# EAGLE design AutonomousBot_Shield (EAGLE 8.5.1)
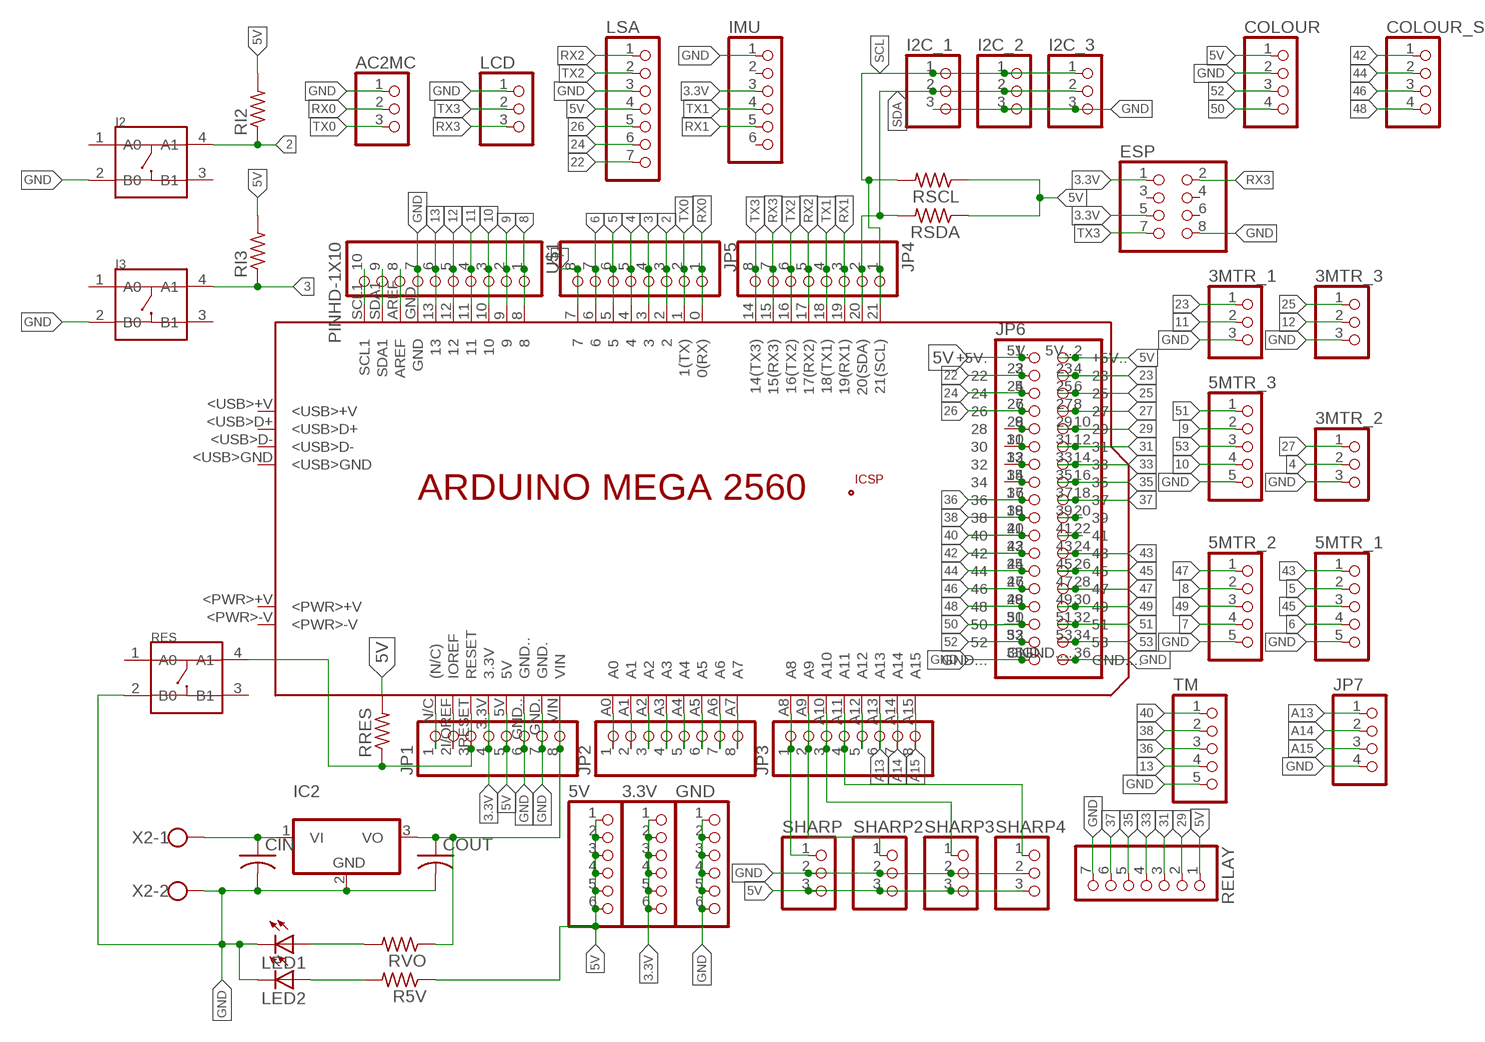
[diagram p0: schematic, sheet 1]

## Parts
3.3V  PINHD-1X6  [1X06]
3MTR_1  PINHD-1X3  [1X03]
3MTR_2  PINHD-1X3  [1X03]
3MTR_3  PINHD-1X3  [1X03]
5MTR_1  PINHD-1X5  [1X05]
5MTR_2  PINHD-1X5  [1X05]
5MTR_3  PINHD-1X5  [1X05]
5V  PINHD-1X6  [1X06]
AC2MC  PINHD-1X3  [1X03]
CIN  C-US025-024X044  [C025-024X044]
COLOUR  PINHD-1X4  [1X04]
COLOUR_S  PINHD-1X4  [1X04]
COUT  C-US025-024X044  [C025-024X044]
ESP  PINHD-2X4  [2X04]
GND  PINHD-1X6  [1X06]
I2  DIP-SWITCH-TACTILE-SPST-NO/TS-1109(4P-D6.0MM)'TS-1109'  [SW4-6.0X6.0X5.0MM]
I2C_1  PINHD-1X3  [1X03]
I2C_2  PINHD-1X3  [1X03]
I2C_3  PINHD-1X3  [1X03]
I3  DIP-SWITCH-TACTILE-SPST-NO/TS-1109(4P-D6.0MM)'TS-1109'  [SW4-6.0X6.0X5.0MM]
IC2  7812TV  [TO220V]
IMU  PINHD-1X6  [1X06]
JP1  PINHD-1X8BIG  [1X08-BIG]
JP2  PINHD-1X8BIG  [1X08-BIG]
JP3  PINHD-1X8BIG  [1X08-BIG]
JP4  PINHD-1X8BIG  [1X08-BIG]
JP5  PINHD-1X8BIG  [1X08-BIG]
JP6  PINHD-2X18  [2X18]
JP7  PINHD-1X4  [1X04]
LCD  PINHD-1X3  [1X03]
LED1  LED5MM  [LED5MM]
LED2  LED5MM  [LED5MM]
LSA  PINHD-1X7  [1X07]
PCB1  ARDUINO_MEGA2560  [ARDUINO_MEGA2560]
R5V  R-US_0207/7  [0207/7]
RELAY  PINHD-1X7  [1X07]
RES  DIP-SWITCH-TACTILE-SPST-NO/TS-1109(4P-D6.0MM)'TS-1109'  [SW4-6.0X6.0X5.0MM]
RI2  R-US_0207/7  [0207/7]
RI3  R-US_0207/7  [0207/7]
RRES  R-US_0207/7  [0207/7]
RSCL  R-US_0207/7  [0207/7]
RSDA  R-US_0207/7  [0207/7]
RVO  R-US_0207/7  [0207/7]
SHARP  PINHD-1X3  [1X03]
SHARP2  PINHD-1X3  [1X03]
SHARP3  PINHD-1X3  [1X03]
SHARP4  PINHD-1X3  [1X03]
TM  PINHD-1X5  [1X05]
U$1  PINHD-1X10  [1X10-BIG]
X2  W237-102  [W237-102]

## Nets
2: I2.4(A1) JP5.3 PCB1.2 RI2.1
3: I3.4(A1) JP5.4 PCB1.3 RI3.1
3.3V: 3.3V.1 3.3V.2 3.3V.3 3.3V.4 3.3V.5 3.3V.6 ESP.1 ESP.5 IMU.3 JP1.4 PCB1.3.3V
4: 3MTR_2.2 JP5.5 PCB1.4
5: 5MTR_1.2 JP5.6 PCB1.5
5V: 5V.1 5V.2 5V.3 5V.4 5V.5 5V.6 COLOUR.1 JP1.5 JP6.1 JP6.2 LSA.4 PCB1.5V PCB1.5V.(+5V.) PCB1.5V..(+5V..) R5V.1 RELAY.1 RI2.2 RI3.2 RRES.2 RSCL.1 RSDA.1 SHARP2.3 SHARP3.3 SHARP4.3 SHARP.3
6: 5MTR_1.4 JP5.7 PCB1.6
7: 5MTR_2.4 JP5.8 PCB1.7
8: 5MTR_2.2 PCB1.8 U$1.1
9: 5MTR_3.2 PCB1.9 U$1.2
10: 5MTR_3.4 PCB1.10 U$1.3
11: 3MTR_1.2 PCB1.11 U$1.4
12: 3MTR_3.2 PCB1.12 U$1.5
13: PCB1.13 TM.4 U$1.6
22: JP6.3 LSA.7 PCB1.22
23: 3MTR_1.1 JP6.4 PCB1.23
24: JP6.5 LSA.6 PCB1.24
25: 3MTR_3.1 JP6.6 PCB1.25
26: JP6.7 LSA.5 PCB1.26
27: 3MTR_2.1 JP6.8 PCB1.27
29: JP6.10 PCB1.29 RELAY.2
31: JP6.12 PCB1.31 RELAY.3
33: JP6.14 PCB1.33 RELAY.4
35: JP6.16 PCB1.35 RELAY.5
36: JP6.17 PCB1.36 TM.3
37: JP6.18 PCB1.37 RELAY.6
38: JP6.19 PCB1.38 TM.2
40: JP6.21 PCB1.40 TM.1
42: COLOUR_S.1 JP6.23 PCB1.42
43: 5MTR_1.1 JP6.24 PCB1.43
44: COLOUR_S.2 JP6.25 PCB1.44
45: 5MTR_1.3 JP6.26 PCB1.45
46: COLOUR_S.3 JP6.27 PCB1.46
47: 5MTR_2.1 JP6.28 PCB1.47
48: COLOUR_S.4 JP6.29 PCB1.48
49: 5MTR_2.3 JP6.30 PCB1.49
50: COLOUR.4 JP6.31 PCB1.50
51: 5MTR_3.1 JP6.32 PCB1.51
52: COLOUR.3 JP6.33 PCB1.52
53: 5MTR_3.3 JP6.34 PCB1.53
A13: JP3.6 JP7.1 PCB1.A13
A14: JP3.7 JP7.2 PCB1.A14
A15: JP3.8 JP7.3 PCB1.A15
GND: 3MTR_1.3 3MTR_2.3 3MTR_3.3 5MTR_1.5 5MTR_2.5 5MTR_3.5 AC2MC.1 CIN.2 COLOUR.2 COUT.2 ESP.8 GND.1 GND.2 GND.3 GND.4 GND.5 GND.6 I2.2(B0) I2C_1.3 I2C_2.3 I2C_3.3 I3.2(B0) IC2.2(GND) IMU.1 JP1.6 JP1.7 JP6.35 JP6.36 JP7.4 LCD.1 LED1.K(C) LED2.K(C) LSA.3 PCB1.GND PCB1.GND. PCB1.GND.. PCB1.GND... PCB1.GND.... RELAY.7 RES.2(B0) SHARP2.2 SHARP3.2 SHARP4.2 SHARP.2 TM.5 U$1.7 X2.2
N$1: CIN.1 IC2.1(VI) X2.1
N$2: COUT.1 IC2.3(VO) JP1.8 PCB1.VIN RVO.1
N$3: LED2.A R5V.2
N$4: LED1.A RVO.2
N$5: JP1.3 PCB1.RESET RES.4(A1) RRES.1
N$6: JP1.2 PCB1.I/OREF(IOREF)
N$7: JP1.1 PCB1.N/C((N/C))
N$8: JP6.9 PCB1.28
N$9: JP2.1 PCB1.A0
N$10: JP2.2 PCB1.A1
N$11: JP2.3 PCB1.A2
N$12: JP2.4 PCB1.A3
N$13: JP2.5 PCB1.A4
N$14: JP6.20 PCB1.39
N$15: JP6.22 PCB1.41
N$16: JP2.6 PCB1.A5
N$17: JP2.7 PCB1.A6
N$18: JP2.8 PCB1.A7
N$19: JP3.1 PCB1.A8 SHARP.1
N$20: JP3.2 PCB1.A9 SHARP2.1
N$21: JP3.3 PCB1.A10 SHARP3.1
N$22: JP3.4 PCB1.A11 SHARP4.1
N$23: JP3.5 PCB1.A12
N$50: PCB1.AREF U$1.8
N$51: PCB1.SDA1 U$1.9
N$52: PCB1.SCL1 U$1.10
N$63: JP6.15 PCB1.34
N$64: JP6.13 PCB1.32
N$65: JP6.11 PCB1.30
RX0: AC2MC.2 JP5.1 PCB1.0(0(RX))
RX1: IMU.5 JP4.3 PCB1.19(19(RX1))
RX2: JP4.5 LSA.1 PCB1.17(17(RX2))
RX3: ESP.2 JP4.7 LCD.3 PCB1.15(15(RX3))
SCL: I2C_1.1 I2C_2.1 I2C_3.1 JP4.1 PCB1.21(21(SCL)) RSCL.2
SDA: I2C_1.2 I2C_2.2 I2C_3.2 JP4.2 PCB1.20(20(SDA)) RSDA.2
TX0: AC2MC.3 JP5.2 PCB1.1(1(TX))
TX1: IMU.4 JP4.4 PCB1.18(18(TX1))
TX2: JP4.6 LSA.2 PCB1.16(16(TX2))
TX3: ESP.7 JP4.8 LCD.2 PCB1.14(14(TX3))
Unconnected: ESP.3 ESP.4 ESP.6 I2.1(A0) I2.3(B1) I3.1(A0) I3.3(B1) IMU.2 IMU.6 PCB1.+5V_ PCB1.<PWR>+V PCB1.<PWR>-V PCB1.<USB>+V PCB1.<USB>D+ PCB1.<USB>D- PCB1.<USB>GND PCB1.GND__ PCB1.MISO PCB1.MOSI PCB1.RESET. PCB1.SCK RES.1(A0) RES.3(B1)

## Library data of the parts
3.3V 5V GND IMU = adafruit:PINHD-1X6: PIN HEADER
3MTR_1-3MTR_3 = pinhead:PINHD-1X3: PIN HEADER
5MTR_1-5MTR_3 TM = pinhead:PINHD-1X5: PIN HEADER
AC2MC I2C_1-I2C_3 LCD SHARP SHARP2-SHARP4 = adafruit:PINHD-1X3: PIN HEADER
CIN COUT = adafruit:C-US: CAPACITOR, American symbol
COLOUR COLOUR_S JP7 = pinhead:PINHD-1X4: PIN HEADER
ESP = adafruit:PINHD-2X4: PIN HEADER
I2 I3 RES = Seeed-Switch:DIP-SWITCH-TACTILE-SPST-NO/TS-1109(4P-D6.0MM): 311020024
IC2 = linear:78*: Positive VOLTAGE REGULATOR Source: http://cache.national.com/ds/LM/LM78L05.pdf http://www.fairchildsemi.com/ds/LM/LM7805.pdf
JP1-JP5 = adafruit:PINHD-1X8: PIN HEADER
JP6 = pinhead:PINHD-2X18: PIN HEADER
LED1 LED2 = adafruit:LED: LED OSRAM: - CHIPLED LG R971, LG N971, LY N971, LG Q971, LY Q971, LO R971, LY R971 LH N974, LH R974 LS Q976, LO Q976, LY Q976 LO Q996 - Hyper CHIPLED LW Q18S LB Q993, LB Q99A, LB R99A - SideLED LS A670, LO A670, LY A670, LG A670, LP A670 LB A673, LV A673, LT A673, LW A673 LH A674 LY A675 LS A676, LA A676, LO A676, LY A676, LW A676 LS A679, LY A679, LG A679 - Hyper Micro SIDELED® LS Y876, LA Y876, LO Y876, LY Y876 LT Y87S - SmartLED LW L88C, LW L88S LB L89C, LB L89S, LG L890 LS L89K, LO L89K, LY L89K LS L896, LA L896, LO L896, LY L896 - TOPLED LS T670, LO T670, LY T670, LG T670, LP T670 LSG T670, LSP T670, LSY T670, LOP T670, LYG T670 LG T671, LOG T671, LSG T671 LB T673, LV T673, LT T673, LW T673 LH T674 LS T676, LA T676, LO T676, LY T676, LB T676, LH T676, LSB T676, LW T676 LB T67C, LV T67C, LT T67C, LS T67K, LO T67K, LY T67K, LW E67C LS E67B, LA E67B, LO E67B, LY E67B, LB E67C, LV E67C, LT E67C LW T67C LS T679, LY T679, LG T679 LS T770, LO T770, LY T770, LG T770, LP T770 LB T773, LV T773, LT T773, LW T773 LH T774 LS E675, LA E675, LY E675, LS T675 LS T776, LA T776, LO T776, LY T776, LB T776 LHGB T686 LT T68C, LB T68C - Hyper Mini TOPLED® LB M676 - Mini TOPLED Santana® LG M470 LS M47K, LO M47K, LY M47K Source: http://www.osram.convergy.de/
LSA RELAY = pinhead:PINHD-1X7: PIN HEADER
PCB1 = E14_Arduino_revC:ARDUINO_MEGA2560: Device for representing an Arduino Mega 2560 board with a footprint in an EAGLE design. Created by Dave Young for Element14. More EAGLE documentation at: http://www.element14.com/community/community/knode/cadsoft_eagle
R5V RI2 RI3 RRES RSCL RSDA RVO = adafruit:R-US_: RESISTOR, American symbol
U$1 = adafruit:PINHD-1X10: Pin header 1x10 0.1" spacing With round pins
X2 = con-wago-500:W237-102: WAGO SCREW CLAMP; MPN: 237-102; OC_FARNELL: unknown; OC_NEWARK: 70K9898

## Board
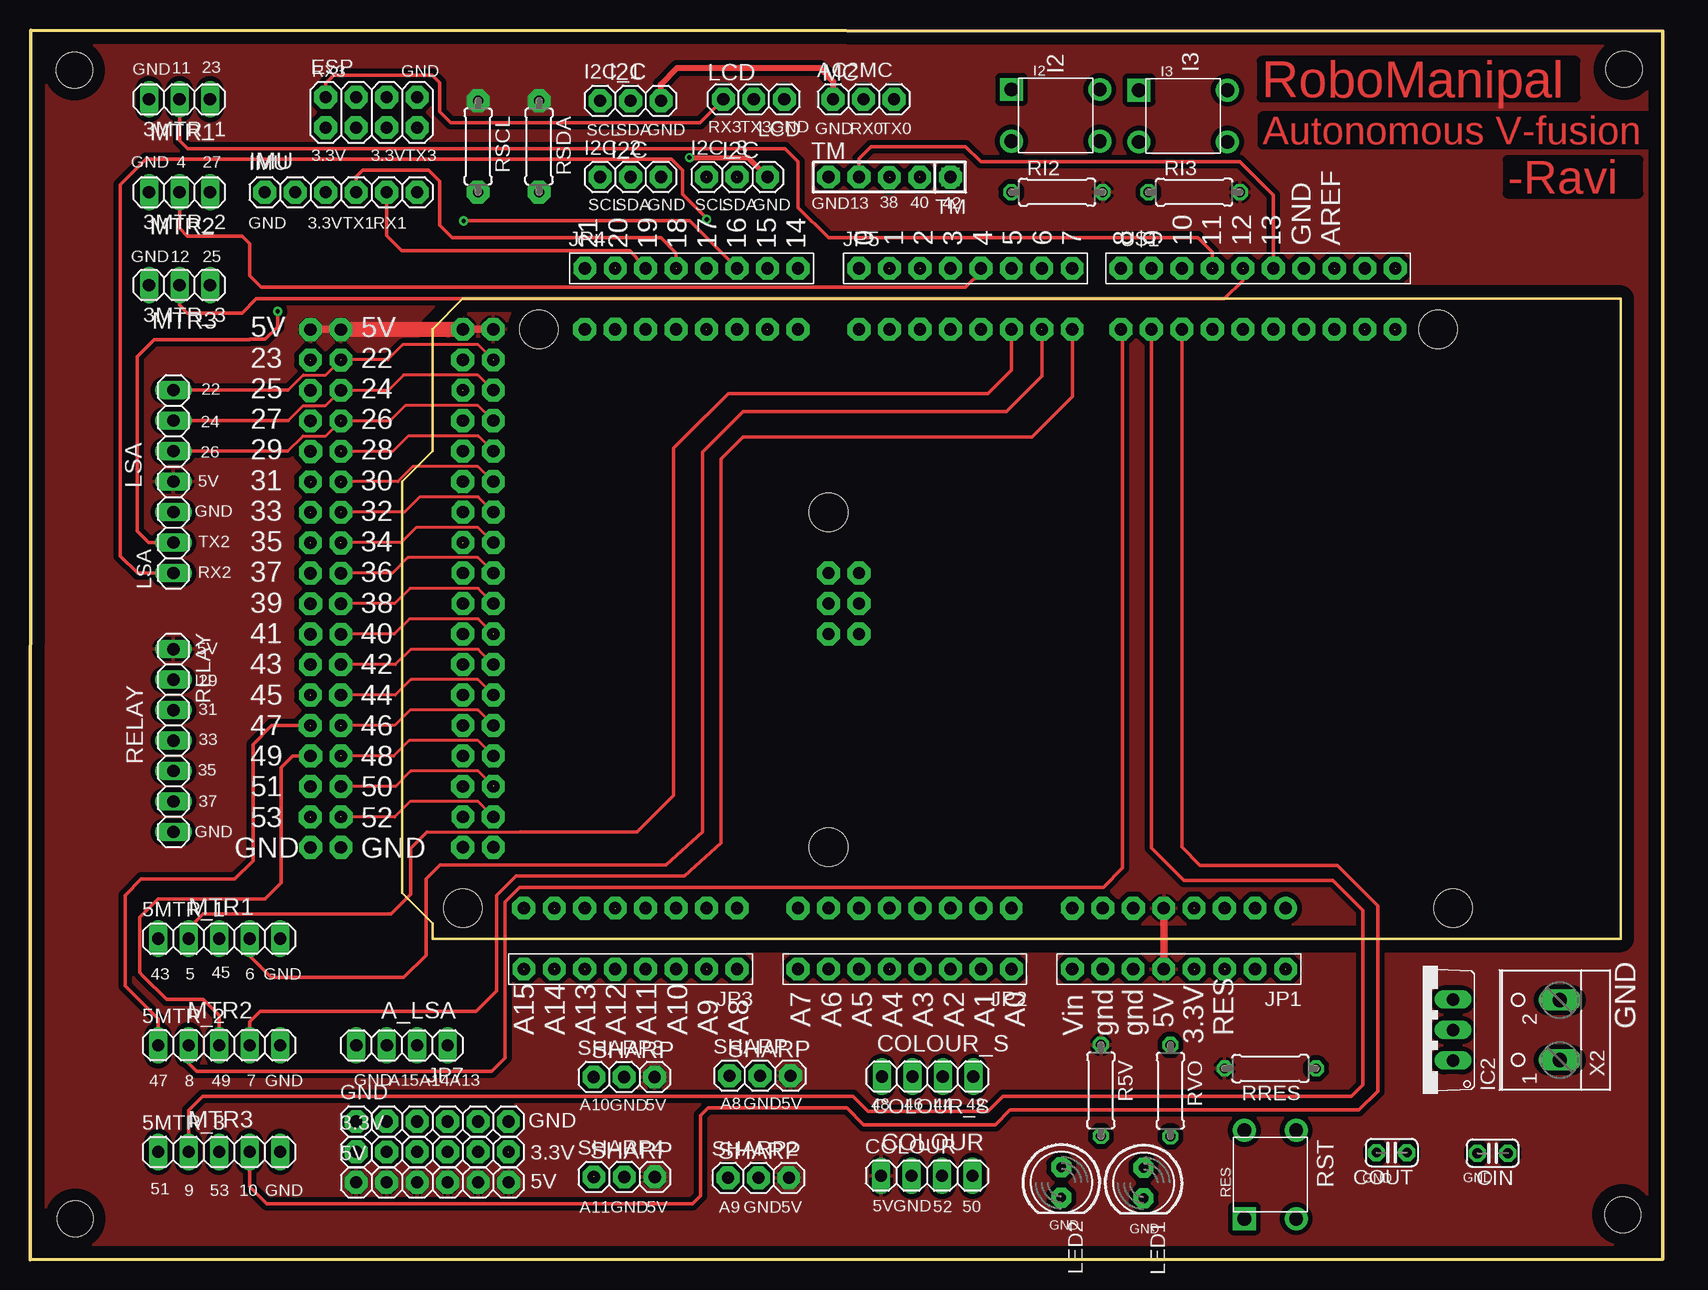
[diagram p1: board, top side]
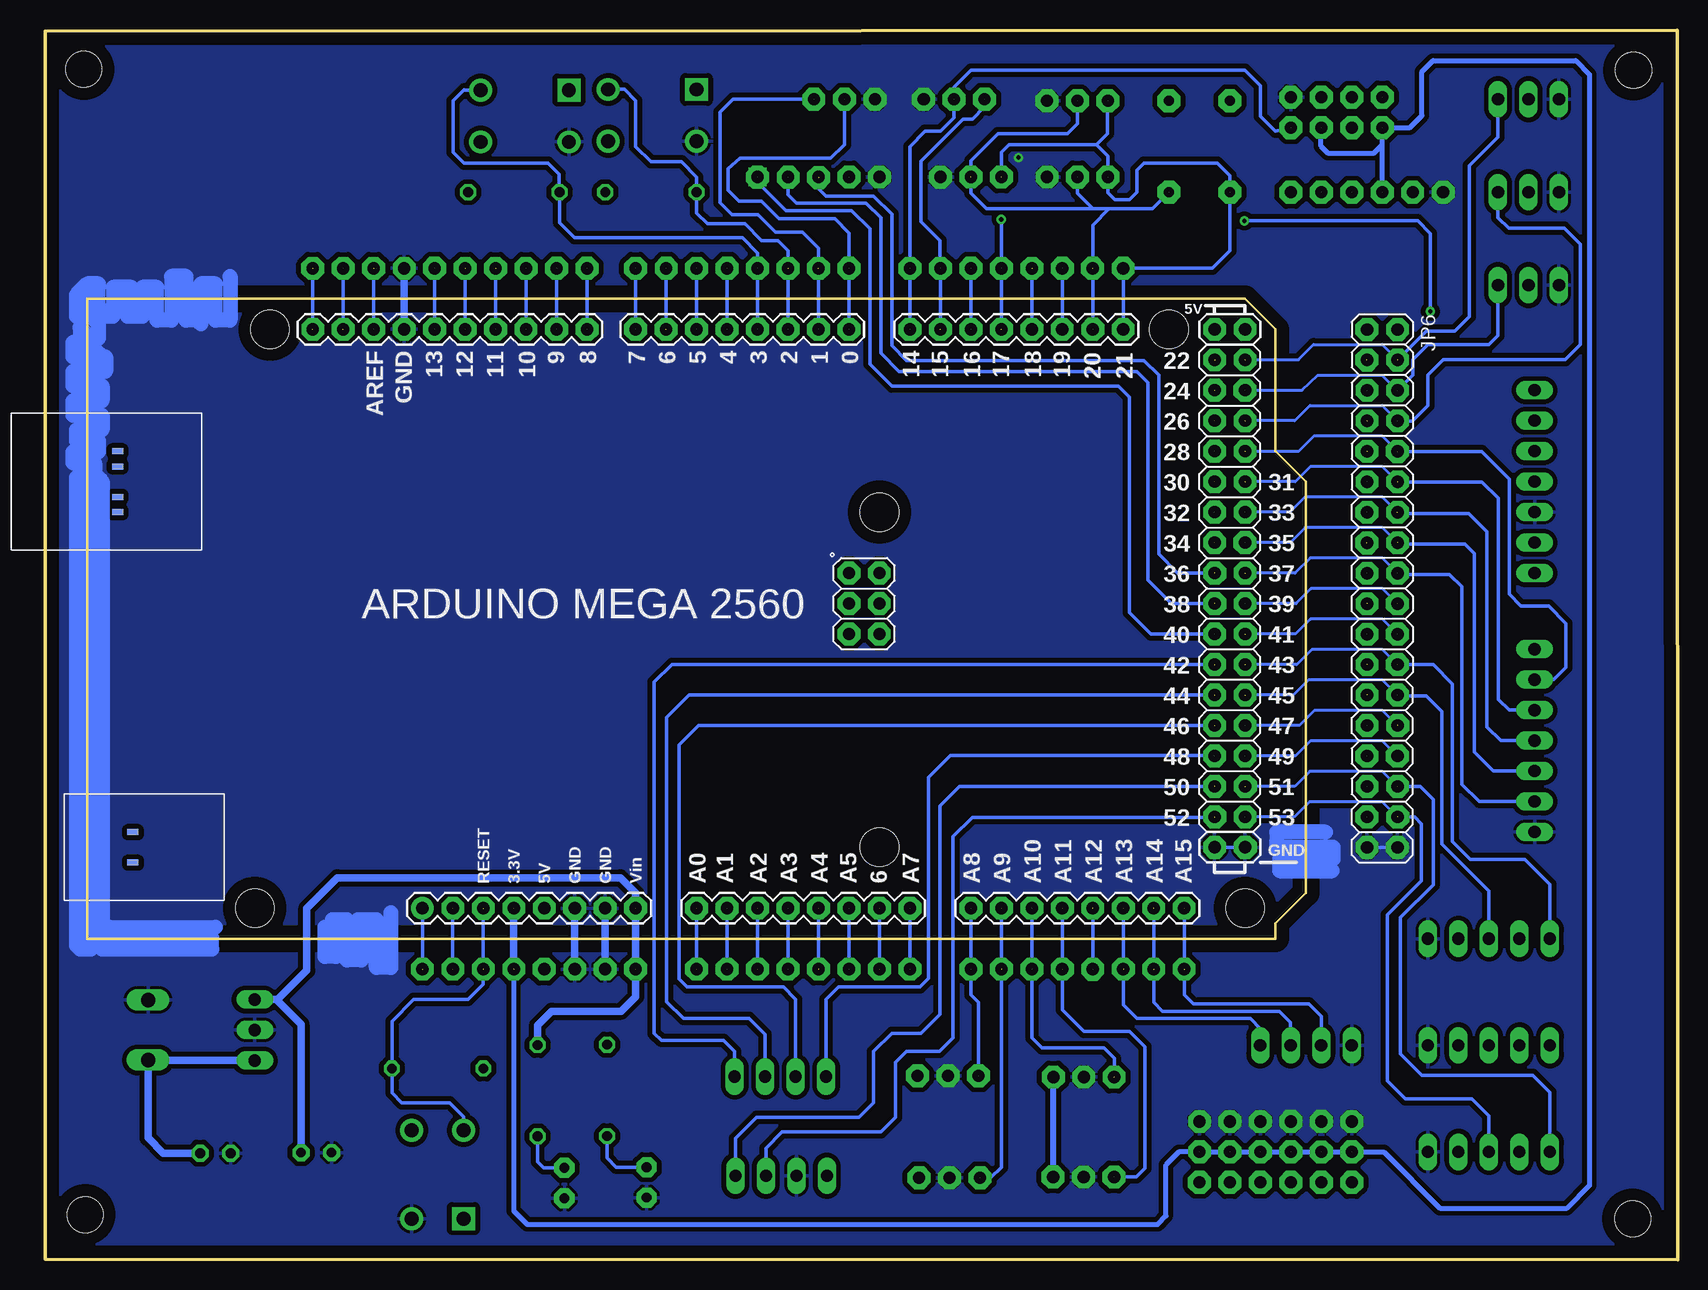
[diagram p2: board, bottom side, seen from below]

Size 136.09 x 102.53 mm. Coordinates in mm from the lower left corner, seen from the top.
Outline: 0,0 136.09,0.05 136.09,102.44 0.07,102.53 0,0
Copper layers (1*16): Top 0.035mm / dielectric 1.5mm / Bottom 0.035mm
Design rules "default": minimum track width 6mil, minimum drill 0.35mm, track to track 6mil, track to pad 6mil, pad to pad 6mil, via to via 6mil, smd to smd 6mil, copper to edge 40mil, drill to drill 6mil, minimum pad ring 10mil, minimum via ring 8mil, stop-mask expansion 4mil, vias tented up to drill 0mil, thermal gap 10mil
Holes 3 mm at 3.78,3.42 3.71,99.18 132.88,99.25 132.76,3.77

### Footprints (pad centres in the part's own frame; a part is rotated, then mirrored left to right if it is on the bottom)
1X06 = drill 1.016 octagon: 1 -6.35,0; 2 -3.81,0; 3 -1.27,0; 4 1.27,0; 5 3.81,0; 6 6.35,0
1X03 = drill 1.016 long: 1 -2.54,0; 2 0,0; 3 2.54,0
1X05 = drill 1.016 long: 1 -5.08,0; 2 -2.54,0; 3 0,0; 4 2.54,0; 5 5.08,0
1X03' = drill 1.016: 1 -2.54,0; 2 0,0; 3 2.54,0
C025-024X044 = drill 0.813 pad 1.422 octagon: 1 -1.27,0; 2 1.27,0
1X04 = drill 1.016 long: 1 -3.81,0; 2 -1.27,0; 3 1.27,0; 4 3.81,0
2X04 = drill 1.016 pad 1.676 octagon: 1 -3.81,-1.27; 2 -3.81,1.27; 3 -1.27,-1.27; 4 -1.27,1.27; 5 1.27,-1.27; 6 1.27,1.27; 7 3.81,-1.27; 8 3.81,1.27
SW4-6.0X6.0X5.0MM = drill 1.143 pad 1.905 square: 1 -3.683,2.159 | drill 1.143 pad 1.905: 2 -3.683,-2.159; 3 3.683,-2.159; 4 3.683,2.159
TO220V = drill 1.016 long: 1 -2.54,-2.54; 2 0,-2.54; 3 2.54,-2.54
1X08-BIG = drill 1.016 pad 1.778 octagon: 1 -8.89,0; 2 -6.35,0; 3 -3.81,0; 4 -1.27,0; 5 1.27,0; 6 3.81,0; 7 6.35,0; 8 8.89,0
2X18 = drill 1.016 octagon: 1 -21.59,-1.27; 2 -21.59,1.27; 3 -19.05,-1.27; 4 -19.05,1.27; 5 -16.51,-1.27; 6 -16.51,1.27; 7 -13.97,-1.27; 8 -13.97,1.27; 9 -11.43,-1.27; 10 -11.43,1.27; 11 -8.89,-1.27; 12 -8.89,1.27; 13 -6.35,-1.27; 14 -6.35,1.27; 15 -3.81,-1.27; 16 -3.81,1.27; 17 -1.27,-1.27; 18 -1.27,1.27; 19 1.27,-1.27; 20 1.27,1.27; 21 3.81,-1.27; 22 3.81,1.27; 23 6.35,-1.27; 24 6.35,1.27; 25 8.89,-1.27; 26 8.89,1.27; 27 11.43,-1.27; 28 11.43,1.27; 29 13.97,-1.27; 30 13.97,1.27; 31 16.51,-1.27; 32 16.51,1.27; 33 19.05,-1.27; 34 19.05,1.27; 35 21.59,-1.27; 36 21.59,1.27
LED5MM = drill 0.813 pad 1.676 octagon: A -1.27,0; K 1.27,0
1X07 = drill 1.016 long: 1 -7.62,0; 2 -5.08,0; 3 -2.54,0; 4 0,0; 5 2.54,0; 6 5.08,0; 7 7.62,0
ARDUINO_MEGA2560 = drill 1.016 pad 1.88: 0 63.5,50.8; 1 60.96,50.8; 2 58.42,50.8; 3 55.88,50.8; 3.3V 35.56,2.54; 4 53.34,50.8; 5 50.8,50.8; 5V 38.1,2.54; 5V. 93.98,50.8; 5V.. 96.52,50.8; 6 48.26,50.8; 7 45.72,50.8; 8 41.656,50.8; 9 39.116,50.8; 10 36.576,50.8; 11 34.036,50.8; 12 31.496,50.8; 13 28.956,50.8; 14 68.58,50.8; 15 71.12,50.8; 16 73.66,50.8; 17 76.2,50.8; 18 78.74,50.8; 19 81.28,50.8; 20 83.82,50.8; 21 86.36,50.8; A0 50.8,2.54; A1 53.34,2.54; A2 55.88,2.54; A3 58.42,2.54; A4 60.96,2.54; A5 63.5,2.54; A6 66.04,2.54; A7 68.58,2.54; A8 73.66,2.54; A9 76.2,2.54; A10 78.74,2.54; A11 81.28,2.54; A12 83.82,2.54; A13 86.36,2.54; A14 88.9,2.54; A15 91.44,2.54; AREF 23.876,50.8; GND 26.416,50.8; GND. 43.18,2.54; GND.. 40.64,2.54; GND... 93.98,7.62; GND.... 96.52,7.62; I/OREF 30.48,2.54; N/C 27.94,2.54; RESET 33.02,2.54; SCL1 18.796,50.8; SDA1 21.336,50.8; VIN 45.72,2.54 | drill 1.016 pad 1.88 octagon: 22 93.98,48.26; 23 96.52,48.26; 24 93.98,45.72; 25 96.52,45.72; 26 93.98,43.18; 27 96.52,43.18; 28 93.98,40.64; 29 96.52,40.64; 30 93.98,38.1; 31 96.52,38.1; 32 93.98,35.56; 33 96.52,35.56; 34 93.98,33.02; 35 96.52,33.02; 36 93.98,30.48; 37 96.52,30.48; 38 93.98,27.94; 39 96.52,27.94; 40 93.98,25.4; 41 96.52,25.4; 42 93.98,22.86; 43 96.52,22.86; 44 93.98,20.32; 45 96.52,20.32; 46 93.98,17.78; 47 96.52,17.78; 48 93.98,15.24; 49 96.52,15.24; 50 93.98,12.7; 51 96.52,12.7; 52 93.98,10.16; 53 96.52,10.16; +5V_ 66.04,30.48; GND__ 66.04,25.4; MISO 63.5,30.48; MOSI 66.04,27.94; RESET. 63.5,25.4; SCK 63.5,27.94 | smd 1.016 x 0.508: <PWR>+V 3.81,8.89; <PWR>-V 3.81,6.35; <USB>+V 2.54,40.64; <USB>D+ 2.54,39.37; <USB>D- 2.54,36.83; <USB>GND 2.54,35.56 | hole 3.2: 15.24,50.8; 13.97,2.54; 66.04,35.56; 66.04,7.62; 90.17,50.8; 96.52,2.54
0207/7 = drill 0.813 octagon: 1 -3.81,0; 2 3.81,0
1X05' = drill 1.016 square: 1 -5.08,0 | drill 1.016 octagon: 2 -2.54,0; 3 0,0; 4 2.54,0; 5 5.08,0
1X10-BIG = drill 1.016 pad 1.778 octagon: 1 -11.43,0; 2 -8.89,0; 3 -6.35,0; 4 -3.81,0; 5 -1.27,0; 6 1.27,0; 7 3.81,0; 8 6.35,0; 9 8.89,0; 10 11.43,0
W237-102 = drill 1.194 long: 1 -2.5,-1.27; 2 2.5,-1.27

### Placement (x,y rotation side)
3.3V  33.54,9 0 top
3MTR_1  12.46,96.75 180 top
3MTR_2  12.46,89.01 180 top
3MTR_3  12.46,81.26 180 top
5MTR_1  15.76,26.78 0 top
5MTR_2  15.76,17.89 0 top
5MTR_3  15.76,9 0 top
5V  33.54,6.46 0 top
AC2MC  [1X03']  69.48,96.75 0 top
CIN  121.92,8.89 180 top
COLOUR  74.76,7.01 0 top
COLOUR_S  74.82,15.28 180 top
COUT  113.51,8.94 180 top
ESP  28.46,95.66 0 top
GND  33.54,11.54 0 top
I2  85.49,95.42 0 top
I2C_1  [1X03']  50.05,96.63 0 top
I2C_2  [1X03']  50.05,90.28 0 top
I2C_3  [1X03']  58.94,90.28 0 top
I3  96.13,95.36 0 top
IC2  116.09,19.16 90 top
IMU  25.92,89.01 0 top
JP1  95.77,24.24 180 top
JP2  72.91,24.24 180 top
JP3  50.05,24.24 180 top
JP4  55.13,82.66 0 top
JP5  77.99,82.66 0 top
JP6  24.65,55.97 270 bottom
JP7  31.01,17.88 180 top
LCD  [1X03']  60.34,96.75 180 top
LED1  92.83,6.41 270 top
LED2  85.97,6.46 270 top
LSA  11.95,64.88 90 top
PCB1  132.6,26.78 0 bottom
R5V  89.27,14.13 270 top
RELAY  11.95,43.29 270 top
RES  103.39,7.12 90 top
RI2  85.61,89.01 0 top
RI3  97.04,89.01 0 top
RRES  103.39,15.96 180 top
RSCL  37.35,92.82 270 top
RSDA  42.43,92.82 270 top
RVO  95.06,14.1 270 top
SHARP  [1X03']  60.85,15.35 0 top
SHARP2  [1X03']  60.72,6.84 0 top
SHARP3  [1X03']  49.53,15.24 0 top
SHARP4  [1X03']  49.54,6.91 0 top
TM  [1X05']  71.64,90.28 180 top
U$1  102.38,82.66 0 top
X2  126.25,19.16 90 top

### Tracks (layer width: path | path; a pad name or v marks a point on that pad's centre or on a via)
2  (via drill 0.75 pad 1.91)  (2 unrouted)
  Bottom 0.305: PCB1.2 JP5.3 | JP5.3 74.18,82.78 | 77.77,86.36 77.79,86.36 | 77.79,86.36 79.16,86.36 79.17,86.38 80.9,86.38 81.8,87.28 RI2.1 81.8,90.28 83.07,91.55 85.61,91.55 86.88,92.82 86.88,96.64 87.82,97.58 I2.4 | JP5.3 74.18,84.15 75.01,84.97 76.4,84.97 77.79,86.36
  other vias: 74.18,82.65 74.19,77.58
3  (via drill 0.75 pad 1.91)  (2 unrouted)
  Bottom 0.305: PCB1.3 JP5.4 76.72,83.93 77.99,85.2 91.96,85.2 93.23,86.47 RI3.1 93.27,89.04 93.27,90.53 94.18,91.44 101.19,91.44 102.11,92.35 102.11,96.62 101.19,97.54 101.17,97.52 I3.4
  other vias: 76.73,82.66 76.72,77.58
3.3V  (via drill 0.65 pad 1.91, 0.75 pad 1.91)  (11 unrouted)
  Bottom 0.305: 29.75,94.07 ESP.5
  Bottom 0.406: 29.75,94.07 29.75,92.86 29.17,92.28 25.34,92.28 24.65,92.96 | IMU.3 24.65,92.96 | 24.65,92.96 ESP.1 | 24.35,94.39 ESP.1 | JP1.4 97.04,14.61 97.04,14.33 97.04,4.08 95.92,2.96 43.37,2.96 42.67,3.66 42.67,7.93 41.6,9 3.3V.6 3.3V.5 3.3V.4 | ESP.1 22.34,94.39 21.33,95.4 21.33,99.06 20.42,99.97 8.53,99.97 7.37,98.81 7.37,6.21 9.26,4.32 19.85,4.32 24.53,9 3.3V.1 | 3.3V.4 | 3.3V.4 v32.28,9 | 3.3V.3 3.3V.2 v29.73,8.99 | 3.3V.2 3.3V.1
  Bottom 0.61: PCB1.3.3V JP1.4
  other vias: 27.19,9 34.81,9 37.35,9 39.87,9.02 24.65,89.01 29.73,94.4 24.65,94.39 97.04,29.32 97.04,24.24
4  (via drill 0.75 pad 1.91)  (2 unrouted)
  Top 0.305: 79.26,82.63 JP5.5 79.26,82.36 77.99,81.09 19.25,81.09 18.3,82.04 18.3,84.72 17.68,85.34 13.1,85.34 12.46,85.99 3MTR_2.2
  Bottom 0.305: PCB1.4 JP5.5
  other vias: 79.26,82.67 79.27,77.58
5  (via drill 0.75 pad 1.91)  (2 unrouted)
  Top 0.254: 33.12,35.67 40.85,35.67
  Top 0.305: 5MTR_1.2 13.22,27.62 14.45,28.85 30.11,28.85 31.75,30.48 31.75,34.29 33.12,35.67 | 81.82,77.55 PCB1.5 81.8,74.18 79.86,72.24 58.22,72.24 54.56,68.58 53.95,67.97 53.64,67.67 53.64,38.71 50.6,35.66 40.85,35.66 40.85,35.67 40.84,35.66
  Bottom 0.305: PCB1.5 JP5.6
  other vias: 81.8,82.66 81.8,77.57
5V  (via drill 0.75 pad 1.91)
  Top 0.61: PCB1.5V JP1.5 | JP6.2 23.39,77.58 25.93,77.58 | 36.07,77.56 PCB1.5V.. PCB1.5V.
  Top 1.27: 25.93,77.58 PCB1.5V..
  Top 1.778: JP6.1 25.93,77.58
  Bottom 0.508: SHARP3.3 52.09,15.22 v52.09,6.91
  other vias: 94.5,29.32 94.5,24.24 63.26,6.84 63.39,15.35 52.07,15.24 27.19,6.45 29.73,6.46 32.28,6.45 34.81,6.47 37.35,6.45 39.89,6.47 37.35,96.63 42.44,96.62 38.62,77.58 36.08,77.58 25.92,77.56 23.38,77.56
  pour Top (isolate 0.406): -1.27,104.14 -1.27,-1.27 138.43,-1.27 138.43,104.14
6  (via drill 0.75 pad 1.91)  (2 unrouted)
  Top 0.305: 5MTR_1.4 18.3,25.35 20.12,23.53 31.15,23.53 33.02,25.4 33.02,31.75 34.19,32.92 53.03,32.92 56.08,35.66 56.08,67.36 59.43,70.71 81.38,70.71 84.34,73.68 PCB1.6 v84.35,77.57
  Bottom 0.305: PCB1.6 JP5.7
  other vias: 84.33,82.66
7  (via drill 0.75 pad 1.91)  (2 unrouted)
  Top 0.305: 86.84,77.54 PCB1.7 86.88,71.95 83.51,68.58 59.43,68.58 57.61,66.75 57.61,34.75 54.56,32 40.53,32 38.9,30.38 38.9,22.45 37.18,20.73 19.2,20.73 18.3,19.83 5MTR_2.4
  Bottom 0.305: PCB1.7 JP5.8
  other vias: 86.88,82.66 86.88,77.58
8  (via drill 0.75 pad 1.91)  (2 unrouted)
  Top 0.305: PCB1.8 91.08,77.45 91.08,32.66 89.48,31.06 40.81,31.06 39.59,29.85 39.59,29.84 39.59,16.84 38.48,15.73 13.89,15.73 13.22,16.4 5MTR_2.2
  Bottom 0.305: PCB1.8 U$1.1
  other vias: 90.94,82.67 90.94,77.58
9  (via drill 0.75 pad 1.91)  (2 unrouted)
  Top 0.305: 13.22,10.34 5MTR_3.2 13.22,12.49 14.39,13.65 16.69,13.65 | PCB1.9 93.49,34.35 96.19,31.64 108.6,31.64 110.73,29.51 110.74,29.51 111.1,29.15 111.1,14.61 110.15,13.66 81.12,13.66 79.86,12.4 69.85,12.4 68.59,13.66 58.23,13.66 57.46,13.65 16.69,13.65 | 16.69,13.65
  Bottom 0.305: PCB1.9 U$1.2
  other vias: 93.48,82.66 93.48,77.58
10  (via drill 0.75 pad 1.91)  (2 unrouted)
  Top 0.305: 18.3,8.25 5MTR_3.4 18.3,6.1 19.74,4.67 19.76,4.69 55.24,4.69 55.88,5.32 55.88,12.07 56.5,12.69 68.08,12.69 69.49,11.28 80.47,11.28 81.68,12.5 110.78,12.5 112.34,14.06 112.34,29.52 108.96,32.9 97.53,32.9 96.03,34.41 PCB1.10
  Bottom 0.305: PCB1.10 U$1.3
  other vias: 96.02,82.66 96.03,77.58
11  (via drill 0.75 pad 1.91)  (2 unrouted)
  Top 0.305: U$1.4 98.57,84 97.36,85.2 66.56,85.2 64.02,87.74 64.02,91.55 62.94,92.63 13.14,92.63 12.46,93.31 3MTR_1.2
  Bottom 0.305: PCB1.11 U$1.4
  other vias: 98.57,82.66 98.57,77.58
12  (via drill 0.75 pad 1.91)  (2 unrouted)
  Top 0.305: U$1.5 101.11,81.64 99.58,80.12 20.69,80.12 18.85,80.12 17.68,78.94 13.1,78.94 12.46,79.59 3MTR_3.2
  Bottom 0.305: PCB1.12 U$1.5
  other vias: 101.09,82.65 101.11,77.57
13  (via drill 0.75 pad 1.91)  (3 unrouted)
  Top 0.305: U$1.6 103.65,88.75 100.85,91.55 79.26,91.55 77.99,92.82 70.11,92.82 69.1,91.81 TM.4
  Bottom 0.305: PCB1.13 U$1.6
  other vias: 69.1,90.28 103.64,77.58 103.65,82.67
22  (via drill 0.75 pad 1.91)  (2 unrouted)
  Top 0.254: PCB1.22 37.36,76.3 31.08,76.3 29.82,75.04 25.93,75.04 | 21.5,72.5 22.78,73.77 24.66,73.77 JP6.3
  Top 0.305: LSA.7 20.32,72.5 20.84,72.5 21.5,72.5 | 25.93,75.04 JP6.3
  other vias: 25.92,75.02 38.62,75.03
23  (via drill 0.75 pad 1.91)  (2 unrouted)
  Bottom 0.254: PCB1.23 31.64,75.04 30.38,76.3 24.66,76.3 JP6.4
  Bottom 0.305: 3MTR_1.1 15,93.58 17.37,91.21 17.37,78.64 18.59,77.42 20.98,77.42 JP6.4
  other vias: 23.37,75.02 36.08,75.04
24  (via drill 0.75 pad 1.91)  (2 unrouted)
  Top 0.254: PCB1.24 37.34,73.78 31.15,73.78 29.85,72.48 JP6.5 24.64,71.2 22.76,71.2 21.52,69.96
  Top 0.305: LSA.6 21.52,69.96 | JP6.5
  other vias: 25.91,72.49 38.62,72.5
25  (via drill 0.75 pad 1.91)  (2 unrouted)
  Bottom 0.254: PCB1.25 31.34,72.5 30.03,73.75 24.68,73.75 JP6.6
  Bottom 0.305: 3MTR_3.1 15,77.07 15.76,76.31 20.84,76.31 22.11,75.04 22.11,73.77 23.37,72.5 JP6.6
  other vias: 23.38,72.48 36.09,72.5
26  (via drill 0.75 pad 1.91)  (2 unrouted)
  Top 0.254: PCB1.26 37.35,71.23 31.28,71.23 30,69.94 JP6.7 24.66,68.69 22.75,68.69 21.48,67.42
  Top 0.305: LSA.5 20.32,67.42 20.84,67.42 21.48,67.42
  other vias: 25.91,69.95 38.62,69.96
27  (via drill 0.75 pad 1.91)  (2 unrouted)
  Bottom 0.254: PCB1.27 31.93,69.96 30.67,71.23 24.66,71.23 JP6.8
  Bottom 0.305: JP6.8 22.13,69.94 20.84,71.23 20.84,73.77 19.57,75.04 9.41,75.04 8.14,76.31 8.14,84.67 9.49,86.01 14.11,86.01 15,86.9 3MTR_2.1
  other vias: 23.38,69.94 36.07,69.96
29  (via drill 0.75 pad 1.91)  (2 unrouted)
  Bottom 0.254: JP6.10 24.65,68.67 30.36,68.67 31.63,67.4 v36.07,67.4
  Bottom 0.305: RELAY.2 10.35,48.37 9.34,49.38 9.34,53.06 10.78,54.5 13.08,54.5 14.07,55.49 14.07,65.1 16.37,67.4 JP6.10 | v36.07,67.4 PCB1.29
  other vias: 23.38,67.4
31  (via drill 0.75 pad 1.91)  (2 unrouted)
  Bottom 0.254: JP6.12 24.65,66.14 30.62,66.14 31.9,64.86 v36.07,64.86
  Bottom 0.305: v36.07,64.86 PCB1.31 | JP6.12 16.34,64.86 14.98,63.5 14.98,46.73 14.07,45.83 RELAY.3
  other vias: 23.38,64.86
33  (via drill 0.75 pad 1.91)  (2 unrouted)
  Bottom 0.254: JP6.14 24.64,63.59 31.11,63.59 32.36,62.34 PCB1.33
  Bottom 0.305: 12.78,43.29 RELAY.4 14.78,43.29 15.92,44.44 15.92,47.46 15.91,47.47 15.91,60.72 17.42,62.23 23.28,62.23 JP6.14
  other vias: 23.38,62.32 36.08,62.34
35  (via drill 0.75 pad 1.91)  (2 unrouted)
  Bottom 0.254: JP6.16 24.64,61.05 31.07,61.05 32.31,59.81 PCB1.35
  Bottom 0.305: 12.96,40.75 RELAY.5 15.38,40.75 16.98,42.35 16.98,58.89 17.78,59.69 23.28,59.69 JP6.16 | PCB1.35
  other vias: 23.37,59.78 36.09,59.8
36  (via drill 0.75 pad 1.91)  (3 unrouted)
  Top 0.254: PCB1.36 37.35,58.53 31.5,58.53 30.21,57.24 JP6.17
  Bottom 0.305: TM.3 71.64,89.32 71.02,88.7 67.05,88.7 65.53,87.17 65.53,76.2 64.31,74.98 44.5,74.98 43.28,73.76 43.28,58.83 41.71,57.26 PCB1.36
  other vias: 25.91,57.24 38.61,57.25 71.63,90.22
37  (via drill 0.75 pad 1.91)  (2 unrouted)
  Bottom 0.254: JP6.18 24.66,58.53 30.65,58.53 31.92,57.26 PCB1.37
  Bottom 0.305: 12.62,38.21 RELAY.6 16.58,38.21 18.02,39.65 18.02,43.61 18.03,43.61 18.03,56.13 19.05,57.15 23.28,57.15 JP6.18
  other vias: 23.38,57.25 36.08,57.26
38  (via drill 0.75 pad 1.91)  (3 unrouted)
  Top 0.254: PCB1.38 37.36,55.98 31.67,55.98 30.39,54.7 JP6.19
  Bottom 0.305: TM.2 74.18,88.81 73.46,88.09 67.66,88.09 66.44,86.87 66.44,75.59 64.92,74.07 45.11,74.07 44.19,73.15 44.19,56.69 42.22,54.72 PCB1.38
  other vias: 25.91,54.7 38.61,54.72 74.17,90.26
40  (via drill 0.75 pad 1.91)  (3 unrouted)
  Top 0.254: PCB1.40 37.36,53.44 31.64,53.44 30.36,52.16 JP6.21
  Bottom 0.305: TM.1 76.72,89.83 74.37,87.48 68.88,87.48 67.36,85.95 67.36,74.68 65.53,72.85 46.63,72.85 45.72,71.93 45.72,53.95 43.95,52.18 PCB1.40
  other vias: 25.92,52.16 38.63,52.17 76.73,90.26
42  (via drill 0.75 pad 1.91)  (2 unrouted)
  Top 0.254: PCB1.42 37.36,50.9 31.73,50.9 30.45,49.62 JP6.23
  Bottom 0.305: COLOUR_S.1 78.63,17.37 79.55,18.29 84.73,18.29 85.34,18.9 85.34,48.16 83.86,49.64 PCB1.42
  other vias: 25.91,49.62 38.62,49.64
43  (via drill 0.75 pad 1.91)  (2 unrouted)
  Bottom 0.254: JP6.24 24.64,50.88 30.52,50.88 31.77,49.63 PCB1.43
  Bottom 0.305: 5MTR_1.1 10.68,31.28 12.78,33.38 17.29,33.38 18.79,34.88 18.79,48.01 20.41,49.62 JP6.24 | PCB1.43
  other vias: 23.38,49.62 36.07,49.64
44  (via drill 0.75 pad 1.91)  (2 unrouted)
  Top 0.254: PCB1.44 37.34,48.38 31.74,48.38 30.45,47.08 JP6.25
  Bottom 0.305: COLOUR_S.2 76.09,18.79 77.42,20.12 82.9,20.12 84.31,21.52 84.31,45.23 82.44,47.1 PCB1.44
  other vias: 25.91,47.09 38.62,47.09
45  (via drill 0.75 pad 1.91)  (2 unrouted)
  Bottom 0.254: JP6.26 24.65,48.35 30.79,48.35 32.04,47.1 PCB1.45
  Bottom 0.305: 5MTR_1.3 15.77,30.74 17.31,32.29 17.31,32.3 19.7,34.69 19.7,45.72 20.97,46.99 23.28,46.99 JP6.26
  other vias: 23.37,47.09 36.08,47.09
46  (via drill 0.75 pad 1.91)  (2 unrouted)
  Top 0.254: PCB1.46 37.35,45.83 31.67,45.83 30.39,44.55 25.92,44.55
  Top 0.305: 25.92,44.55 JP6.27
  Bottom 0.305: COLOUR_S.3 73.55,21.74 74.57,22.75 82.61,22.75 83.28,23.42 83.28,42.91 81.63,44.56 PCB1.46
  other vias: 25.91,44.55 38.62,44.55
47  (via drill 0.75 pad 1.91)  (2 unrouted)
  Top 0.305: 21.68,44.54 JP6.28 20.16,44.54 18.59,42.98 18.59,33.27 17.07,31.75 9.27,31.75 7.92,30.4 7.92,22.86 10.68,20.1 5MTR_2.1
  Bottom 0.254: JP6.28 24.65,45.81 30.3,45.81 31.55,44.56 PCB1.47
  other vias: 23.37,44.55 36.08,44.56
48  (via drill 0.75 pad 1.91)  (2 unrouted)
  Top 0.254: PCB1.48 37.35,43.29 31.6,43.29 30.31,42 JP6.29
  Bottom 0.305: 38.65,41.99 PCB1.48 38.67,42.06 60.65,42.06 62.48,40.23 62.48,23.47 63.19,22.76 69.96,22.76 71.01,21.72 COLOUR_S.4
  other vias: 25.92,42 38.62,42.01
49  (via drill 0.75 pad 1.91)  (1 unrouted)
  Top 0.305: 5MTR_2.3 15.76,20.37 14.42,21.71 11.39,21.71 9.41,23.69 9.14,23.97 9.14,28.56 10.67,30.09 19.59,30.09 20.92,31.42 20.92,39.37 | 20.92,39.37 20.92,39.56 | 20.92,39.37 20.93,39.38 20.93,41.05 21.88,42 JP6.30
  Bottom 0.254: JP6.30 24.64,43.27 30.62,43.27 31.87,42.02 PCB1.49
  other vias: 23.38,42 36.08,42.02
50  (via drill 0.75 pad 1.91)  (2 unrouted)
  Top 0.254: PCB1.50 37.36,40.74 31.75,40.74 30.47,39.46 JP6.31
  Bottom 0.305: 38.63,39.49 PCB1.50 59.89,39.48 61.5,37.86 61.5,20.49 63.09,18.9 65.53,18.9 67.05,17.37 67.05,13.11 68.27,11.89 76.81,11.89 78.57,10.13 COLOUR.4
  other vias: 25.91,39.46 38.62,39.48
51  (via drill 0.75 pad 1.91)  (2 unrouted)
  Bottom 0.254: JP6.32 24.64,40.73 30.69,40.73 31.94,39.48 PCB1.51
  Bottom 0.305: 5MTR_3.1 10.68,13.95 12.1,15.37 21.35,15.37 23.15,17.18 23.15,28.54 20.41,31.28 20.41,38.4 21.47,39.46 JP6.32
  other vias: 23.38,39.47 36.07,39.47
52  (via drill 0.75 pad 1.91)  (2 unrouted)
  Top 0.254: PCB1.52 37.34,38.22 31.7,38.22 30.4,36.92 JP6.33
  Bottom 0.305: PCB1.52 38.66,36.98 38.75,36.88 58.82,36.88 60.42,35.28 60.42,18.52 61.57,17.37 64.31,17.37 65.23,16.46 65.23,11.89 66.44,10.67 74.67,10.67 76.03,9.32 COLOUR.3
  other vias: 25.92,36.92 38.61,36.94
53  (via drill 0.75 pad 1.91)  (2 unrouted)
  Bottom 0.254: JP6.34 24.65,38.2 30.72,38.2 31.99,36.93 v36.07,36.93
  Bottom 0.305: v36.07,36.93 PCB1.53 | JP6.34 21.94,36.92 21.37,36.35 21.37,31.58 24.21,28.74 24.21,14.91 22.72,13.41 17.18,13.41 15.76,11.99 5MTR_3.3
  other vias: 23.37,36.92
A13  (via drill 0.75 pad 1.91)  (2 unrouted)
  Bottom 0.305: PCB1.A13 JP3.6 46.24,21.25 45.11,20.12 35.66,20.12 34.82,19.28 JP7.1
  other vias: 46.24,29.31 46.24,24.24
A14  (via drill 0.75 pad 1.91)  (2 unrouted)
  Bottom 0.305: PCB1.A14 JP3.7 | 43.69,24.22 JP3.7 | JP7.2 32.31,17.91 32.31,19.81 33.22,20.73 42.98,20.73 43.7,21.45 JP3.7
  other vias: 43.71,29.31 43.71,24.24
A15  (via drill 0.75 pad 1.91)  (2 unrouted)
  Bottom 0.305: PCB1.A15 JP3.8 41.16,22.11 40.38,21.34 30.78,21.34 29.74,20.3 JP7.3
  other vias: 41.16,24.24 41.16,29.32
GND  (via drill 0.35, 0.75 pad 1.91)
  Top 0.305: ESP.8 32.27,96.99
  Top 0.406: v54.96,91.9 59.86,91.9 I2C_3.3
  Top 0.508: I2C_1.3 52.59,98.01 53.95,99.37 65.84,99.37 66.94,98.26 AC2MC.1
  Bottom 0.305: 3MTR_2.3 9.92,89.92 | PCB1.GND... PCB1.GND.... v36.07,34.38 | JP6.36 JP6.35 | 33.21,33.41 33.21,33.47 | I2C_2.3 53.04,90.28
  Bottom 0.61: PCB1.GND. JP1.7 | PCB1.GND.. JP1.6 | U$1.7 PCB1.GND
  Bottom 1.27: 29.38,35.67 33.44,35.67 33.46,34.41 28.76,34.41 28.76,33.41 33.21,33.41 33.21,32.44 28.82,32.44 | 107.29,28.96 107.29,24.38 108.51,24.38 108.51,28.35 110.03,28.35 109.73,28.04 109.73,24.99 110.95,24.99 110.95,28.35 112.16,28.35 111.86,28.04 111.86,25.3 112.77,25.3 112.77,27.74 | 120.7,81.99 120.7,78.33 121.92,78.33 121.92,81.38 123.14,81.38 123.14,78.03 123.44,78.33 124.36,78.33 124.36,81.99 125.58,81.99 125.58,78.33 126.8,78.33 126.8,81.08 128.01,81.08 128.01,78.64 129.23,78.64 129.23,80.77 128.93,81.08 130.45,81.08 130.45,78.64 131.67,78.64 131.67,81.38 132.59,81.38 133.5,80.47 133.5,78.64 132.28,78.64 | 132.28,78.64 131.98,78.33 | 132.28,78.64 132.59,78.94 132.59,80.47 131.67,79.55 131.67,76.81 132.28,76.81 133.2,77.72 133.2,76.51 133.81,76.51 133.81,75.29 131.37,75.29 131.98,75.9 132.59,75.9 131.98,75.29 131.06,75.29 131.06,74.07 133.81,74.07 133.81,72.85 131.37,72.85 131.37,71.63 133.81,71.63 133.81,70.41 131.37,70.41 131.37,69.19 133.5,69.19 133.5,68.28 131.67,68.28 131.67,67.36 133.81,67.36 133.81,66.45 131.98,66.45 131.98,65.23 | 131.98,65.23 132.59,65.23 | 132.59,65.23 133.5,65.23 133.5,26.21 133.2,25.91 132.28,25.91 132.28,64.92 132.59,65.23 | 131.98,65.23 131.67,65.23 131.37,64.92 131.37,25.91 122.22,25.91 122.22,26.82 130.76,26.82 130.76,27.74 121.92,27.74
  other vias: 23.38,34.39 25.91,34.39 89.42,29.32 91.97,29.31 89.42,24.23 91.96,24.24 38.62,34.4 49.54,6.91 60.73,6.84 60.84,15.35 49.53,15.24 27.19,11.53 29.74,11.55 32.28,11.54 34.82,11.53 37.35,11.53 39.87,11.53 19.57,89.01 32.27,96.93 52.6,96.63 52.59,90.28 61.48,90.27 66.94,96.75 66.56,90.28 106.17,82.66 106.18,77.57 62.88,96.75
  pour Bottom (isolate 0.406): -1.27,104.14 -1.27,-1.27 138.43,-1.27 138.43,104.14
N$1
  Bottom 0.305: 127.48,16.62 X2.1
  Bottom 0.61: X2.1 127.52,10.16 126.25,8.89 CIN.1 | IC2.1 127.48,16.62
N$2  (via drill 0.75 pad 1.91)  (2 unrouted)
  Bottom 0.305: 86.88,29.28 PCB1.VIN | 116.84,21.7 116.73,21.7 | COUT.1 114.88,9.04 114.78,9.14
  Bottom 0.61: IC2.3 116.84,21.7 114.78,19.64 114.78,9.14 | 116.73,21.7 114.3,24.13 114.3,29.32 111.76,31.86 88.15,31.86 86.88,30.59 86.88,29.28 JP1.8 86.88,21.93 88.09,20.73 93.88,20.73 95.06,19.54 RVO.1
  other vias: 86.88,24.23 86.88,29.31
N$3
  Bottom 0.305: LED2.A 88.5,7.73 89.27,8.5 R5V.2
N$4
  Bottom 0.305: LED1.A 94.54,7.68 95.06,8.19 RVO.2
N$5  (via drill 0.75 pad 1.91)  (2 unrouted)
  Bottom 0.305: PCB1.RESET JP1.3 99.58,22.97 100.85,21.7 105.41,21.7 107.2,19.9 RRES.1 107.2,13.93 106.37,13.11 102.41,13.11 101.23,11.93 RES.4
  other vias: 99.58,29.31 99.58,24.24
N$6  (via drill 0.75 pad 1.91)  (2 unrouted)
  Bottom 0.305: PCB1.I/OREF JP1.2
  other vias: 102.12,29.32 102.12,24.24
N$7  (via drill 0.75 pad 1.91)  (1 unrouted)
  Bottom 0.305: PCB1.N/C JP1.1
  other vias: 104.66,24.24
N$8  (via drill 0.75 pad 1.91)  (2 unrouted)
  Top 0.254: PCB1.28 37.37,68.66 31.51,68.66 30.25,67.4 JP6.9
  other vias: 25.92,67.41 38.62,67.41
N$9  (via drill 0.75 pad 1.91)  (2 unrouted)
  Bottom 0.305: PCB1.A0 JP2.1
  other vias: 81.8,24.24 81.8,29.31
N$10  (via drill 0.75 pad 1.91)  (2 unrouted)
  Bottom 0.305: PCB1.A1 JP2.2
  other vias: 79.27,24.24 79.26,29.31
N$11  (via drill 0.75 pad 1.91)  (2 unrouted)
  Bottom 0.305: PCB1.A2 JP2.3
  other vias: 76.72,24.24 76.72,29.32
N$12  (via drill 0.75 pad 1.91)  (2 unrouted)
  Bottom 0.305: PCB1.A3 JP2.4
  other vias: 74.19,24.24 74.18,29.31
N$13  (via drill 0.75 pad 1.91)  (2 unrouted)
  Bottom 0.305: PCB1.A4 JP2.5
  other vias: 71.64,24.24 71.64,29.32
N$14  (via drill 0.75 pad 1.91)  (2 unrouted)
  Bottom 0.254: JP6.20 24.64,55.97 30.59,55.97 31.84,54.72 PCB1.39
  other vias: 23.38,54.7 36.08,54.71
N$15  (via drill 0.75 pad 1.91)  (2 unrouted)
  Bottom 0.254: JP6.22 24.64,53.42 30.64,53.42 31.89,52.18 PCB1.41
  Bottom 0.305: PCB1.41
  other vias: 23.38,52.17 36.07,52.18
N$16  (via drill 0.75 pad 1.91)  (2 unrouted)
  Bottom 0.305: PCB1.A5 JP2.6
  other vias: 69.1,24.23 69.1,29.31
N$17  (via drill 0.75 pad 1.91)  (2 unrouted)
  Bottom 0.305: PCB1.A6 JP2.7
  other vias: 66.56,24.23 66.56,29.32
N$18  (via drill 0.75 pad 1.91)  (2 unrouted)
  Bottom 0.305: PCB1.A7 JP2.8
  other vias: 64.02,24.24 64.02,29.31
N$19  (via drill 0.75 pad 1.91)  (3 unrouted)
  Bottom 0.305: PCB1.A8 JP3.1 58.94,22.11 58.31,21.48 SHARP.1
  other vias: 58.95,29.32 58.94,24.24 58.31,15.35
N$20  (via drill 0.75 pad 1.91)  (3 unrouted)
  Bottom 0.305: PCB1.A9 JP3.2 56.4,7.73 57.3,6.84 SHARP2.1
  other vias: 56.41,29.32 56.4,24.24 58.18,6.84
N$21  (via drill 0.75 pad 1.91)  (3 unrouted)
  Bottom 0.305: PCB1.A10 JP3.3 53.86,18.51 53.03,17.68 47.85,17.68 46.99,16.82 SHARP3.1
  other vias: 53.86,29.32 53.86,24.23 47,15.24
N$22  (via drill 0.75 pad 1.91)  (3 unrouted)
  Bottom 0.305: PCB1.A11 JP3.4 51.32,20.84 49.53,19.05 45.72,19.05 44.45,17.78 44.45,7.62 45.16,6.91 SHARP4.1
  other vias: 51.32,29.32 51.32,24.23 47.01,6.91
N$23  (via drill 0.75 pad 1.91)  (2 unrouted)
  Bottom 0.305: PCB1.A12 JP3.5
  other vias: 48.79,29.32 48.79,24.23
N$50  (via drill 0.75 pad 1.91)  (2 unrouted)
  Bottom 0.305: PCB1.AREF U$1.8
  other vias: 108.73,82.66 108.72,77.57
N$51  (via drill 0.75 pad 1.91)  (2 unrouted)
  Bottom 0.305: PCB1.SDA1 U$1.9
  other vias: 111.26,82.66 111.26,77.57
N$52  (via drill 0.75 pad 1.91)  (2 unrouted)
  Bottom 0.305: PCB1.SCL1 U$1.10
  other vias: 113.81,82.66 113.79,77.57
N$63  (via drill 0.75 pad 1.91)  (2 unrouted)
  Top 0.254: PCB1.34 37.35,61.07 32.21,61.07 30.92,59.78 JP6.15
  other vias: 25.92,59.77 38.62,59.8
N$64  (via drill 0.75 pad 1.91)  (2 unrouted)
  Top 0.254: PCB1.32 37.36,63.6 32.5,63.6 31.22,62.32 JP6.13
  other vias: 25.92,62.33 38.62,62.34
N$65  (via drill 0.75 pad 1.91)  (2 unrouted)
  Top 0.254: PCB1.30 37.37,66.13 31.92,66.13 30.66,64.87 25.94,64.87
  Top 0.305: JP6.11 25.93,64.88 25.94,64.87
  other vias: 25.91,64.86 38.62,64.88
N$154  (via drill 0.75 pad 1.91)
  other vias: 22.12,89.01
N$155  (via drill 0.75 pad 1.91)
  other vias: 27.18,94.39
N$175  (via drill 0.75 pad 1.91)
  other vias: 32.28,89
N$210  (via drill 0.75 pad 1.91)
  other vias: 29.73,96.93
N$211  (via drill 0.75 pad 1.91)
  other vias: 27.19,96.93
RX0  (via drill 0.75 pad 1.91)  (3 unrouted)
  Bottom 0.305: PCB1.0 JP5.1 69.1,85.61 70.28,86.79 74.94,86.79 76.41,88.27 78.27,88.27 79.17,89.17 79.17,90.98 78.19,91.84 70.62,91.84 69.48,92.98 AC2MC.2
  other vias: 69.48,96.76 69.1,82.67 69.11,77.57
RX1  (via drill 0.75 pad 1.91)  (2 unrouted)
  Top 0.305: JP4.3 50.02,84.12 30.97,84.12 29.73,85.37 IMU.5
  Bottom 0.305: JP4.3 PCB1.19 v51.33,77.57
  other vias: 51.32,82.67 29.74,89.01
RX2  (via drill 0.35, 0.75 pad 1.91)  (2 unrouted)
  Top 0.305: 10.69,57.26 LSA.1 8.97,57.26 7.54,58.69 7.54,89.63 9.66,91.76 53.49,91.76 54.4,90.85 54.4,88.85 56.41,86.84 v56.41,86.74
  Bottom 0.305: PCB1.17 JP4.5 56.4,86.73 v56.41,86.74
  other vias: 56.39,82.66 56.41,77.57
RX3  (via drill 0.75 pad 1.91)  (4 unrouted)
  Top 0.305: LCD.3 55.84,94.79 35.05,94.79 34.14,95.71 34.14,98.15 33.53,98.76 25.3,98.76 24.65,98.11 ESP.2
  Bottom 0.305: PCB1.15 JP4.7 61.5,82.68 61.5,84.98 63.1,86.57 63.1,91.61 59.61,95.1 58.82,95.1 57.8,96.12 LCD.3
  other vias: 24.65,96.93 57.8,96.75 61.48,82.66 61.48,77.57
SCL  (via drill 0.75 pad 1.91)  (4 unrouted)
  Bottom 0.305: 46.24,82.55 JP4.1 | JP4.1 PCB1.21 v46.24,77.57 | JP4.1 38.82,82.66 37.34,84.14 37.34,89 RSCL.2 37.35,90.39 38.4,91.44 44.5,91.44 45.11,90.83 45.11,89 45.72,88.39 46.94,88.39 47.51,88.97 I2C_2.1 47.51,92.01 48.46,92.96 | JP4.1 v46.25,82.67 | I2C_3.1 56.39,90.29 56.39,92.35 55.78,92.96 48.46,92.96 | I2C_1.1 v47.52,96.63 | 48.46,92.96 47.55,93.88 47.55,96.59 I2C_1.1
  other vias: 47.52,90.27 56.4,90.28 37.35,89.01
SDA  (via drill 0.75 pad 1.91)  (6 unrouted)
  Bottom 0.305: PCB1.20 JP4.2 48.78,86.27 47.42,87.63 | RSDA.2 43.81,87.63 47.42,87.63 | 48.77,87.63 57.64,87.63 58.94,88.93 I2C_3.2 58.94,91.63 56.69,93.88 50.9,93.88 50.05,94.73 I2C_1.2 | 50.06,89.38 v50.06,90.27 | 48.77,87.63 47.42,87.63 | I2C_2.2 50.05,88.92 48.77,87.63
  other vias: 50.06,96.63 58.94,90.28 42.43,89.02 48.78,77.58 48.8,82.67
TX0  (via drill 0.75 pad 1.91)  (3 unrouted)
  Bottom 0.305: AC2MC.3 72.17,96.75 | 72.17,96.75 74.85,96.75 | PCB1.1 JP5.2 71.64,84.34 72.96,85.66 75.22,85.66 76.68,87.12 78.85,87.12 79.86,88.13 79.86,95.68 78.77,96.76 78.77,96.75 72.17,96.75
  other vias: 72.03,96.75 71.65,82.65 71.64,77.58
TX1  (via drill 0.75 pad 1.91)  (2 unrouted)
  Top 0.305: JP4.4 53.86,83.93 52.59,85.2 35.2,85.2 34.14,86.26 34.14,89.92 33.22,90.83 27.74,90.83 27.19,90.29 IMU.4
  Bottom 0.305: JP4.4 PCB1.18
  other vias: 53.85,82.65 53.86,77.58 27.18,89.01
TX2  (via drill 0.35, 0.75 pad 1.91)  (2 unrouted)
  Top 0.305: 11.39,59.8 LSA.2 9.9,59.8 9.88,59.78 8.92,60.74 8.92,75.31 10.35,76.73 18.3,76.73 18.31,76.74 19.62,76.74 20.64,77.76 v20.64,79.07 | v36.15,86.61 54.98,86.61 JP4.6
  Bottom 0.305: JP4.6 PCB1.16 | 36.15,86.49 v36.15,86.61 21.69,86.61 20.64,85.56 v20.64,79.07
  other vias: 58.94,82.66 58.95,77.57
TX3  (via drill 0.75 pad 1.91)  (4 unrouted)
  Bottom 0.305: ESP.7 33.54,94.09 34.81,95.36 34.81,97.9 36.08,99.17 58.94,99.17 60.34,97.77 LCD.2 60.34,95.23 61.48,94.09 62.75,94.09 64.02,92.82 JP4.8 PCB1.14
  other vias: 32.28,94.39 60.34,96.75 64.03,82.66 64.02,77.58

### Text on the board
Top: RoboManipal | Autonomous V-fusion | -Ravi
tPlace: GND | 11 | 23 | RX3 | GND | I2 | I3 | I2C | LCD | MC | SCL | SDA | GND | RX3 | TX3 | GND | GND | RX0 | TX0 | MTR1 | 3.3V | 3.3V | TX3 | I2C | I2C | TM | GND | 4 | 27 | IMU | GND | 13 | 38 | 40 | 42 | SCL | SDA | GND | SCL | SDA | GND | GND | 3.3V | TX1 | RX1 | MTR2 | 0 / 1 / 2 / 3 / 4 / 5 / 6 / 7 | 8 / 9 / 10 / 11 / 12 / 13 / GND / AREF | 21 / 20 / 19 / 18 / 17 / 16 / 15 / 14 | GND | 12 | 25 | MTR3 | 22 | 24 | 26 | 5V | LSA | GND | TX2 | RX2 | 5V | 29 | 31 | 33 | RELAY | 35 | 37 | GND | 5V / 23 / 25 / 27 / 29 / 31 / 33 / 35 / 37 / 39 / 41 / 43 / 45 / 47 / 49 / 51 / 53 / GND | 5V / 22 / 24 / 26 / 28 / 30 / 32 / 34 / 36 / 38 / 40 / 42 / 44 / 46 / 48 / 50 / 52 / GND | MTR1 | 43 | 5 | 45 | 6 | GND | MTR2 | A_LSA | A15 / A14 / A13 / A12 / A11 / A10 / A9 / A8 | A7 / A6 / A5 / A4 / A3 / A2 / A1 / A0 | GND | Vin / gnd / gnd / 5V / 3.3V / RES | SHARP | SHARP | COLOUR_S | GND | 47 | 8 | 49 | 7 | GND | A15 | A14 | A13 | A8 | GND | 5V | A10 | GND | 5V | 48 | 46 | 44 | 42 | MTR3 | GND | COLOUR | 3.3V | SHARP | SHARP | 5V | RST | GND | GND | 51 | 9 | 53 | 10 | GND | A11 | GND | 5V | A9 | GND | 5V | 5V | GND | 52 | 50 | GND | GND